# EAGLE schematic berry_3.0 (EAGLE 6.5.0)
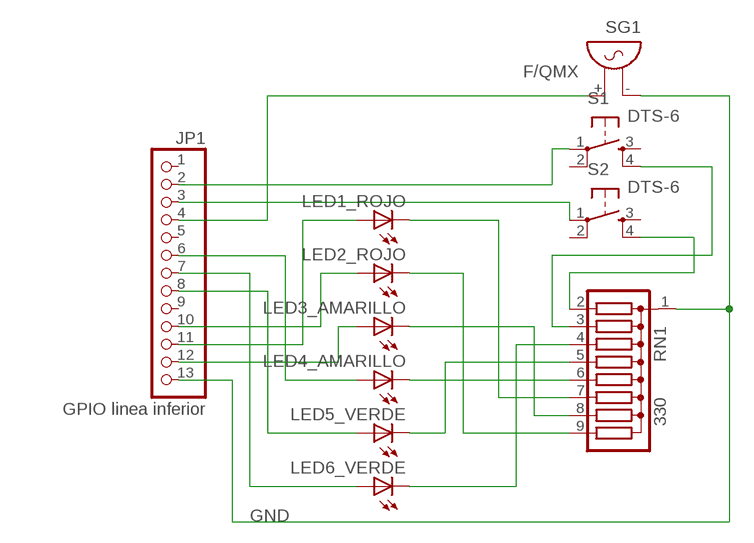
[diagram p0: schematic, sheet 1]

## Parts
JP1  GPIO linea inferior  PINHD-1X13  [1X13]
LED1_ROJO  LED5MM  [LED5MM]
LED2_ROJO  LED5MM  [LED5MM]
LED3_AMARILLO  LED5MM  [LED5MM]
LED4_AMARILLO  LED5MM  [LED5MM]
LED5_VERDE  LED5MM  [LED5MM]
LED6_VERDE  LED5MM  [LED5MM]
RN1  330  G08R  [SIL9]
S1  DTS-6  [DTS-6]
S2  DTS-6  [DTS-6]
SG1  F/QMX  [F/QMX]

## Nets
GND: JP1.13 SG1.-
N$1: LED5_VERDE.K(C) RN1.5
N$2: JP1.2 S1.1
N$4: LED3_AMARILLO.K(C) RN1.8
N$6: JP1.10 LED2_ROJO.A
N$7: LED4_AMARILLO.K(C) RN1.6
N$8: LED2_ROJO.K(C) RN1.9
N$9: JP1.4 SG1.+
N$10: LED1_ROJO.K(C) RN1.7
N$12: LED6_VERDE.K(C) RN1.4
N$13: JP1.7 LED6_VERDE.A
N$14: JP1.8 LED5_VERDE.A
N$15: RN1.2 S2.4
N$16: RN1.3 S1.4
N$17: JP1.11 LED1_ROJO.A
N$18: JP1.3 S2.1
N$19: JP1.6 LED4_AMARILLO.A
N$20: JP1.12 LED3_AMARILLO.A
Unconnected: JP1.1 JP1.5 JP1.9 RN1.1 S1.2 S1.3 S2.2 S2.3

## Library data of the parts
JP1 = pinhead:PINHD-1X13: PIN HEADER
LED1_ROJO LED2_ROJO LED3_AMARILLO LED4_AMARILLO LED5_VERDE LED6_VERDE = led:LED: LED OSRAM: - CHIPLED LG R971, LG N971, LY N971, LG Q971, LY Q971, LO R971, LY R971 LH N974, LH R974 LS Q976, LO Q976, LY Q976 LO Q996 - Hyper CHIPLED LW Q18S LB Q993, LB Q99A, LB R99A - SideLED LS A670, LO A670, LY A670, LG A670, LP A670 LB A673, LV A673, LT A673, LW A673 LH A674 LY A675 LS A676, LA A676, LO A676, LY A676, LW A676 LS A679, LY A679, LG A679 - Hyper Micro SIDELED® LS Y876, LA Y876, LO Y876, LY Y876 LT Y87S - SmartLED LW L88C, LW L88S LB L89C, LB L89S, LG L890 LS L89K, LO L89K, LY L89K LS L896, LA L896, LO L896, LY L896 - TOPLED LS T670, LO T670, LY T670, LG T670, LP T670 LSG T670, LSP T670, LSY T670, LOP T670, LYG T670 LG T671, LOG T671, LSG T671 LB T673, LV T673, LT T673, LW T673 LH T674 LS T676, LA T676, LO T676, LY T676, LB T676, LH T676, LSB T676, LW T676 LB T67C, LV T67C, LT T67C, LS T67K, LO T67K, LY T67K, LW E67C LS E67B, LA E67B, LO E67B, LY E67B, LB E67C, LV E67C, LT E67C LW T67C LS T679, LY T679, LG T679 LS T770, LO T770, LY T770, LG T770, LP T770 LB T773, LV T773, LT T773, LW T773 LH T774 LS E675, LA E675, LY E675, LS T675 LS T776, LA T776, LO T776, LY T776, LB T776 LHGB T686 LT T68C, LB T68C - Hyper Mini TOPLED® LB M676 - Mini TOPLED Santana® LG M470 LS M47K, LO M47K, LY M47K Source: http://www.osram.convergy.de LUXEON: - LUMILED® LXK2-PW12-R00, LXK2-PW12-S00, LXK2-PW14-U00, LXK2-PW14-V00 LXK2-PM12-R00, LXK2-PM12-S00, LXK2-PM14-U00 LXK2-PE12-Q00, LXK2-PE12-R00, LXK2-PE12-S00, LXK2-PE14-T00, LXK2-PE14-U00 LXK2-PB12-K00, LXK2-PB12-L00, LXK2-PB12-M00, LXK2-PB14-N00, LXK2-PB14-P00, LXK2-PB14-Q00 LXK2-PR12-L00, LXK2-PR12-M00, LXK2-PR14-Q00, LXK2-PR14-R00 LXK2-PD12-Q00, LXK2-PD12-R00, LXK2-PD12-S00 LXK2-PH12-R00, LXK2-PH12-S00 LXK2-PL12-P00, LXK2-PL12-Q00, LXK2-PL12-R00 Source: www.luxeon.com KINGBRIGHT: KA-3528ASYC Source: www.kingbright.com
RN1 = resistor-sil:G08R: SIL RESISTOR; OC_FARNELL: unknown; OC_NEWARK: unknown
S1 S2 = switch-tact:DTS-6
SG1 = buzzer:F/QMX: BUZZER Source: Buerklin; OC_FARNELL: unknown; OC_NEWARK: unknown